# Altium schematic sheet LPFADC.SchDoc
size A4
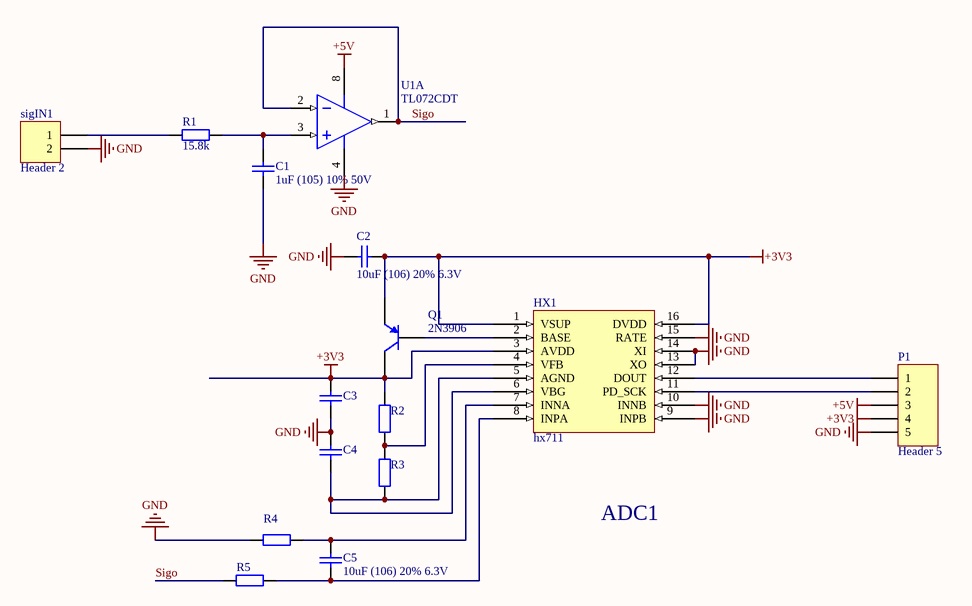
[diagram p0: LPFADC.SchDoc]

## Parts
C1  1uF (105) 10% 50V  [0805_C]
C2  10uF (106) 20% 6.3V  [0402_C]
C3  10uF (106) 20% 6.3V  [0402_C]  (value not drawn)
C4  10uF (106) 20% 6.3V  [0402_C]  (value not drawn)
C5  10uF (106) 20% 6.3V  [0402_C]
HX1  hx711  [HX711]
P1  Header 5  [HDR1X5]
Q1  2N3906  [TO-92A]
R1  15.8k  [0805_R]
R2  10KΩ (1002) ±1%  [0603_R]  (value not drawn)
R3  10KΩ (1002) ±1%  [0603_R]  (value not drawn)
R4  1KΩ (1002) ±1%  [0603_R]  (value not drawn)
R5  1KΩ (1002) ±1%  [0603_R]  (value not drawn)
sigIN1  Header 2  [HDR1X2]
U1  TL072CDT  [SOIC-8_150mil]  (part A of 2)

## Nets
+3V3: C2.2 C3.1 HX1.1(VSUP) HX1.3(AVDD) HX1.16(DVDD) P1.4 Q1.1(E) Q1.3(C) R2.2
+5V: P1.3 U1.8(V+)
GND: C1.1 C2.1 C3.2 C4.1 HX1.9(INPB) HX1.10(INNB) HX1.13(XO) HX1.14(XI) HX1.15(RATE) P1.5 R4.2 sigIN1.2 U1.4(V-)
Sigo: R5.2 U1.1(OUT) U1.2(IN-)
NetC1_2: C1.2 R1.2 U1.3(IN+)
NetC4_2: C4.2 HX1.5(AGND) HX1.6(VBG) R3.1
NetC5_1: C5.1 HX1.7(INNA) R4.1
NetC5_2: C5.2 HX1.8(INPA) R5.1
NetHX1_2: HX1.2(BASE) Q1.2(B)
NetHX1_4: HX1.4(VFB) R2.1 R3.2
NetHX1_11: HX1.11(PD_SCK) P1.2
NetHX1_12: HX1.12(DOUT) P1.1
NetR1_1: R1.1 sigIN1.1

## Notes on the sheet
- ADC1

## Library data of the parts
C1 = 0805 1uF (105) 10% 50V: 贴片电容; ComponentLink1Description: 供应商链接; ComponentLink1URL: http://www.szlcsc.com/product/details_29074.html; Package: 0805; Supplier: LC; SuppliersPartNumber: C28323
C2-C5 = 0402 10uF (106) 20% 6.3V: 贴片电容; ComponentLink1Description: 供应商链接; ComponentLink1URL: http://www.szlcsc.com/product/details_16204.html; Package: 0402; Supplier: LC; SuppliersPartNumber: C15525
P1 = Header 5: Header, 5-Pin; LatestRevisionDate: 17-Jul-2002; LatestRevisionNote: Re-released for DXP Platform.; Publisher: Altium Limited
Q1 = 2N3906: PNP General Purpose Amplifier; Published: 8-Jun-2000; LatestRevisionDate: 15-Jan-2003; LatestRevisionNote: PCB Footprint 'BCY-W3/D4.7' replaced; DatasheetVersion: 1997; PackageVersion: Sep-1998; PackageReference: TO-92A; Publisher: Altium Limited; PackageDescription: TO, Flat Index; 3 In-Line, Axial Leads; Body Dia. 4.5mm; Leads 0.51 x 0.48 mm (max); ComponentLink1Description: Manufacturer Link; ComponentLink1URL: http://www.fairchildsemi.com/; ComponentLink2Description: Datasheet; ComponentLink2URL: http://www.fairchildsemi.com/ds/2N%2F2N3906.pdf
R1 = 0805 330KΩ (3303) 1%: 贴片电阻; ComponentLink1Description: 供应商链接; ComponentLink1URL: http://www.szlcsc.com/product/details_18317.html; Package: 0805; Supplier: LC; SuppliersPartNumber: C17629
R2-R5 = 0603 10KΩ (1002) 1%: 贴片电阻; ComponentLink1Description: 供应商链接; ComponentLink1URL: http://www.szlcsc.com/product/details_26547.html; Package: 0603; Supplier: LC; SuppliersPartNumber: C25804
sigIN1 = Header 2: Header, 2-Pin; LatestRevisionDate: 17-Jul-2002; LatestRevisionNote: Re-released for DXP Platform.; Publisher: Altium Limited
U1 = TL072CDT_[C6961]: 运放; ComponentLink1Description: 供应商链接; ComponentLink1URL: http://www.szlcsc.com/product/details_7433.html; Package: SOIC-8_150mil; Supplier: LC; SuppliersPartNumber: C6961